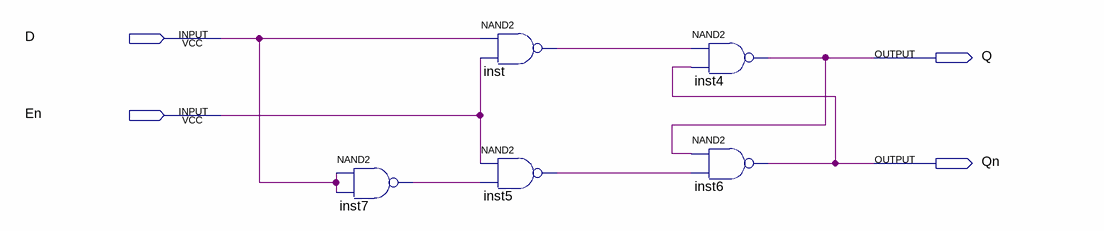
[diagram p0: schematic sheet]
// Quartus schematic D_latch.bdf as structural Verilog: 5 symbols, 4 pins
module D_latch (
  input  D,
  input  En,
  output Q,
  output Qn
);

  wire inst5_out, inst7_out, inst_out;

  nand inst7 (inst7_out, D, D);
  nand inst (inst_out, D, En);
  nand inst5 (inst5_out, En, inst7_out);
  nand inst4 (Q, inst_out, Qn);
  nand inst6 (Qn, Q, inst5_out);
endmodule
